# EAGLE design Teclado_4x1 (EAGLE 7.6.0)
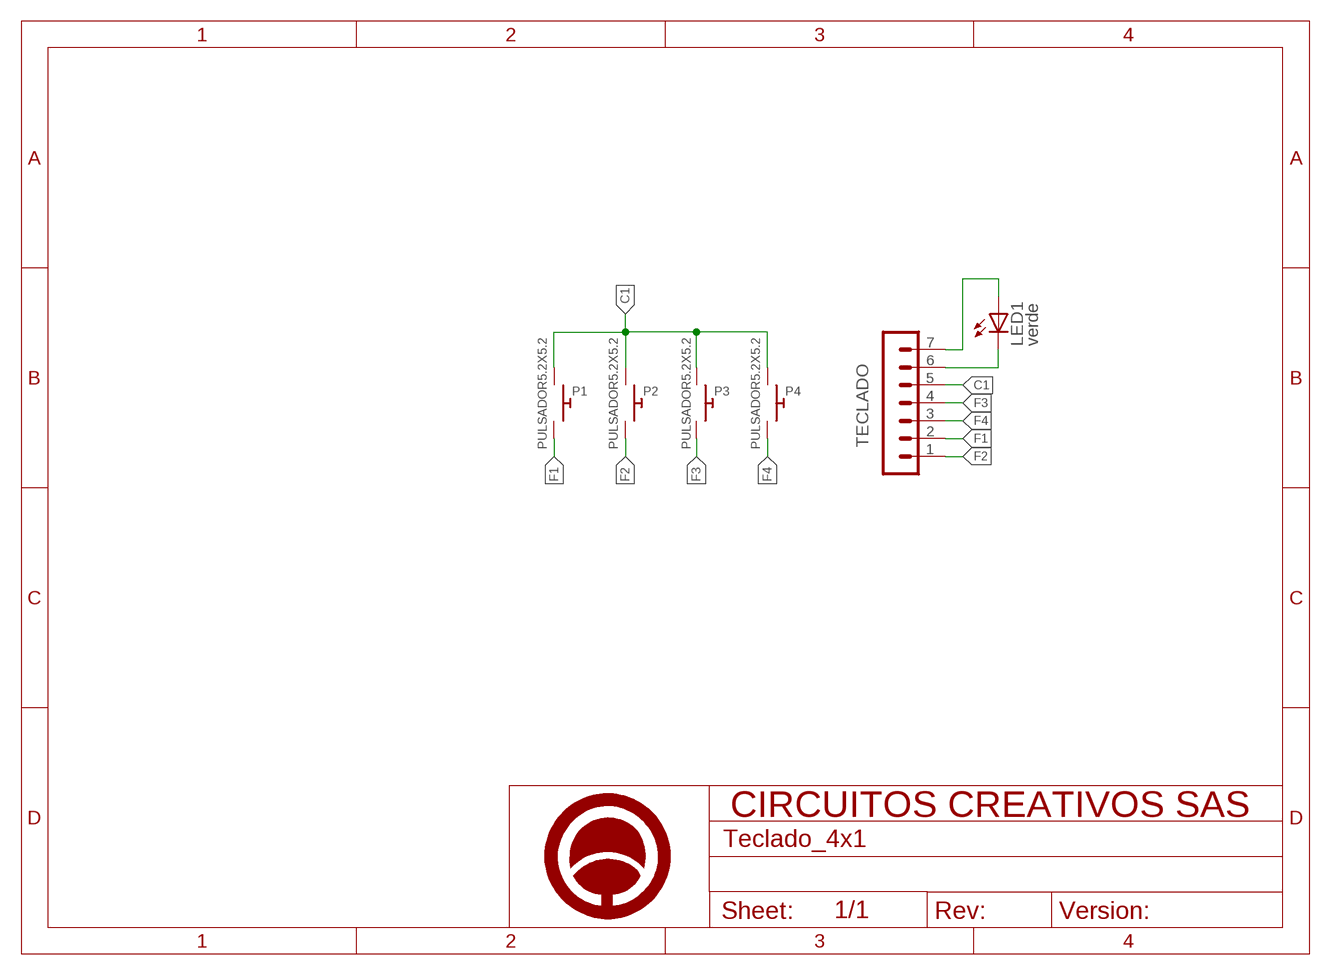
[diagram p0: schematic, sheet 1]

## Parts
LED1  verde  LEDCHIP-LED0805  [CHIP-LED0805]
P1  PULSADOR5.2X5.2  [SMT_5.2X5.2MM]
P2  PULSADOR5.2X5.2  [SMT_5.2X5.2MM]
P3  PULSADOR5.2X5.2  [SMT_5.2X5.2MM]
P4  PULSADOR5.2X5.2  [SMT_5.2X5.2MM]
TECLADO  MA07-1  [MA07-1]
U$1  A5_HORIZONTAL  [LOGO]

## Nets
C1: P1.1 P1.2 P2.1 P2.2 P3.1 P3.2 P4.1 P4.2 TECLADO.5
F1: P1.3 P1.4 TECLADO.2
F2: P2.3 P2.4 TECLADO.1
F3: P3.3 P3.4 TECLADO.4
F4: P4.3 P4.4 TECLADO.3
N$1: LED1.C TECLADO.6
N$2: LED1.A TECLADO.7

## Library data of the parts
LED1 = led:LED: LED OSRAM: - CHIPLED LG R971, LG N971, LY N971, LG Q971, LY Q971, LO R971, LY R971 LH N974, LH R974 LS Q976, LO Q976, LY Q976 LO Q996 - Hyper CHIPLED LW Q18S LB Q993, LB Q99A, LB R99A - SideLED LS A670, LO A670, LY A670, LG A670, LP A670 LB A673, LV A673, LT A673, LW A673 LH A674 LY A675 LS A676, LA A676, LO A676, LY A676, LW A676 LS A679, LY A679, LG A679 - Hyper Micro SIDELED® LS Y876, LA Y876, LO Y876, LY Y876 LT Y87S - SmartLED LW L88C, LW L88S LB L89C, LB L89S, LG L890 LS L89K, LO L89K, LY L89K LS L896, LA L896, LO L896, LY L896 - TOPLED LS T670, LO T670, LY T670, LG T670, LP T670 LSG T670, LSP T670, LSY T670, LOP T670, LYG T670 LG T671, LOG T671, LSG T671 LB T673, LV T673, LT T673, LW T673 LH T674 LS T676, LA T676, LO T676, LY T676, LB T676, LH T676, LSB T676, LW T676 LB T67C, LV T67C, LT T67C, LS T67K, LO T67K, LY T67K, LW E67C LS E67B, LA E67B, LO E67B, LY E67B, LB E67C, LV E67C, LT E67C LW T67C LS T679, LY T679, LG T679 LS T770, LO T770, LY T770, LG T770, LP T770 LB T773, LV T773, LT T773, LW T773 LH T774 LS E675, LA E675, LY E675, LS T675 LS T776, LA T776, LO T776, LY T776, LB T776 LHGB T686 LT T68C, LB T68C - Hyper Mini TOPLED® LB M676 - Mini TOPLED Santana® LG M470 LS M47K, LO M47K, LY M47K Source: http://www.osram.convergy.de LUXEON: - LUMILED® LXK2-PW12-R00, LXK2-PW12-S00, LXK2-PW14-U00, LXK2-PW14-V00 LXK2-PM12-R00, LXK2-PM12-S00, LXK2-PM14-U00 LXK2-PE12-Q00, LXK2-PE12-R00, LXK2-PE12-S00, LXK2-PE14-T00, LXK2-PE14-U00 LXK2-PB12-K00, LXK2-PB12-L00, LXK2-PB12-M00, LXK2-PB14-N00, LXK2-PB14-P00, LXK2-PB14-Q00 LXK2-PR12-L00, LXK2-PR12-M00, LXK2-PR14-Q00, LXK2-PR14-R00 LXK2-PD12-Q00, LXK2-PD12-R00, LXK2-PD12-S00 LXK2-PH12-R00, LXK2-PH12-S00 LXK2-PL12-P00, LXK2-PL12-Q00, LXK2-PL12-R00 Source: www.luxeon.com KINGBRIGHT: KA-3528ASYC Source: www.kingbright.com
P1-P4 = Circuitos-Creativos-Conectores:PULSADOR: PULSADOR CON LAMINA DE MEMORIA Y TACTIL SMT
TECLADO = con-lstb:MA07-1: PIN HEADER; OC_FARNELL: unknown; OC_NEWARK: unknown
U$1 = Circuitos-Creativos-Estilos:A5_HORIZONTAL

## Board
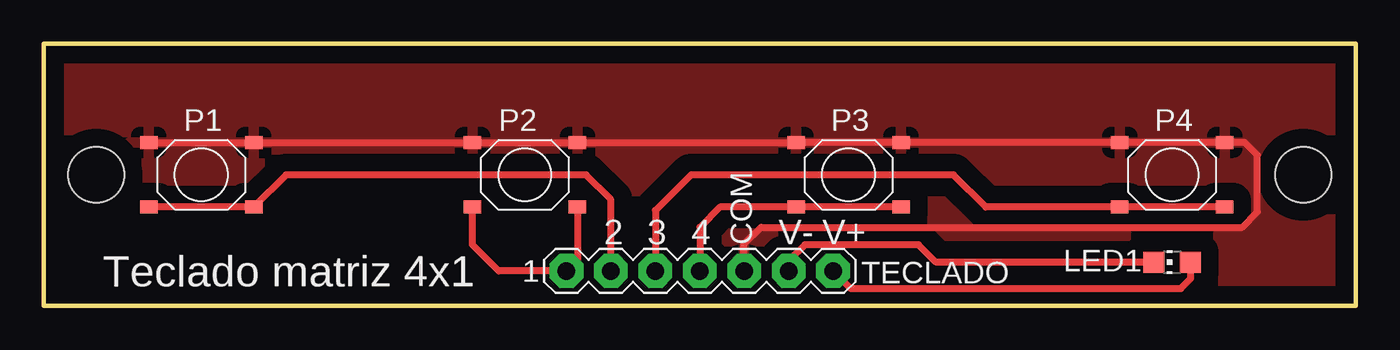
[diagram p1: board, top side]
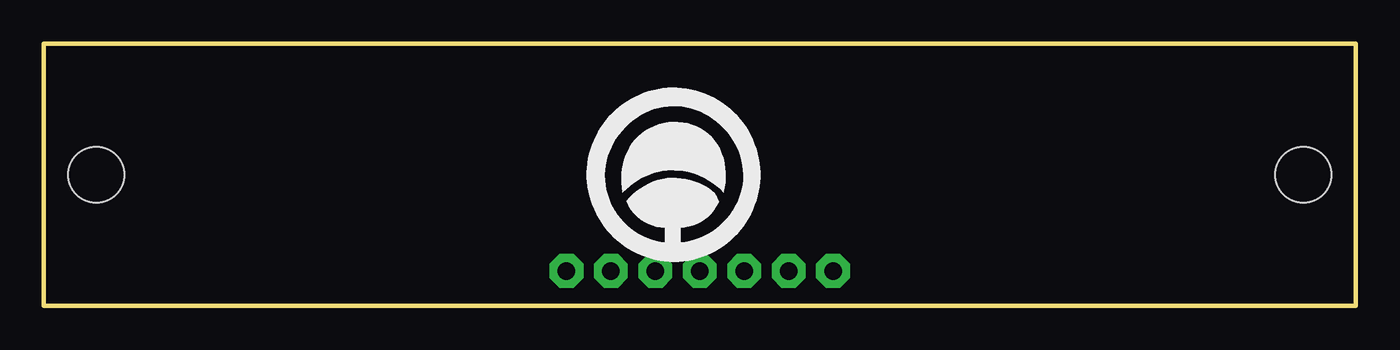
[diagram p2: board, bottom side, seen from below]

Size 75 x 15 mm. Coordinates in mm from the lower left corner, seen from the top.
Outline: 0,0 75,0 75,15 0,15 0,0
Copper layers (1*16): Top 0.035mm / dielectric 1.5mm / Bottom 0.035mm
Design rules "Circuitos_Creativos_2_capas": minimum track width 0.4mm, minimum drill 0.6mm, track to track 10mil, track to pad 10mil, pad to pad 10mil, via to via 10mil, smd to smd 8mil, copper to edge 1mm, drill to drill 15mil, minimum pad ring 0.4mm, minimum via ring 0.4mm, stop-mask expansion 4mil, vias tented up to drill 0mil, thermal gap 20mil
Holes 3.2 mm at 72,7.5 3,7.5

### Footprints (pad centres in the part's own frame; a part is rotated, then mirrored left to right if it is on the bottom)
CHIP-LED0805 = smd 1.2 x 1.2: A 0,-1.05; C 0,1.05
SMT_5.2X5.2MM = smd 1 x 0.75: 1 -3,1.85; 2 3,1.85; 3 -3,-1.85; 4 3,-1.85
MA07-1 = drill 1 pad 1.93 octagon: 1 -7.62,0; 2 -5.08,0; 3 -2.54,0; 4 0,0; 5 2.54,0; 6 5.08,0; 7 7.62,0

### Placement (x,y rotation side)
LED1  64.5,2.5 90 top
P1  9,7.5 0 top
P2  27.5,7.5 0 top
P3  46,7.5 0 top
P4  64.5,7.5 0 top
TECLADO  37.5,2 0 top
U$1  39,7.5 0 bottom

### Tracks (layer width: path | path; a pad name or v marks a point on that pad's centre or on a via)
C1
  Top 0.406: P1.1 P1.2 P2.1 P2.2 P3.1 P3.2 P4.1 P4.2 68.65,9.35 69.38,8.62 69.38,5.38 68.5,4.5 41,4.5 40.04,3.54 TECLADO.5
  pour Top (isolate 1.016): -1,-1 76,-1 76,16 -1,16
F1
  Top 0.406: TECLADO.2 32.42,6.08 31,7.5 13.85,7.5 P1.4 P1.3
F2
  Top 0.406: P2.3 24.5,3.5 26,2 TECLADO.1 30.5,2.62 P2.4
F3
  Top 0.406: P3.4 P3.3 38.65,5.65 37.5,4.5 TECLADO.4
F4
  Top 0.406: P4.4 P4.3 53.85,5.65 52,7.5 37,7.5 34.96,5.46 TECLADO.3
N$1
  Top 0.406: LED1.C 51,2.5 50,3.5 43.5,3.5 42.58,2.58 TECLADO.6
N$2
  Top 0.406: TECLADO.7 46.12,1 65,1 65.55,1.55 LED1.A

### Text on the board
tPlace: 2 | 3 | 4 | COM | V- | V+ | Teclado matriz 4x1